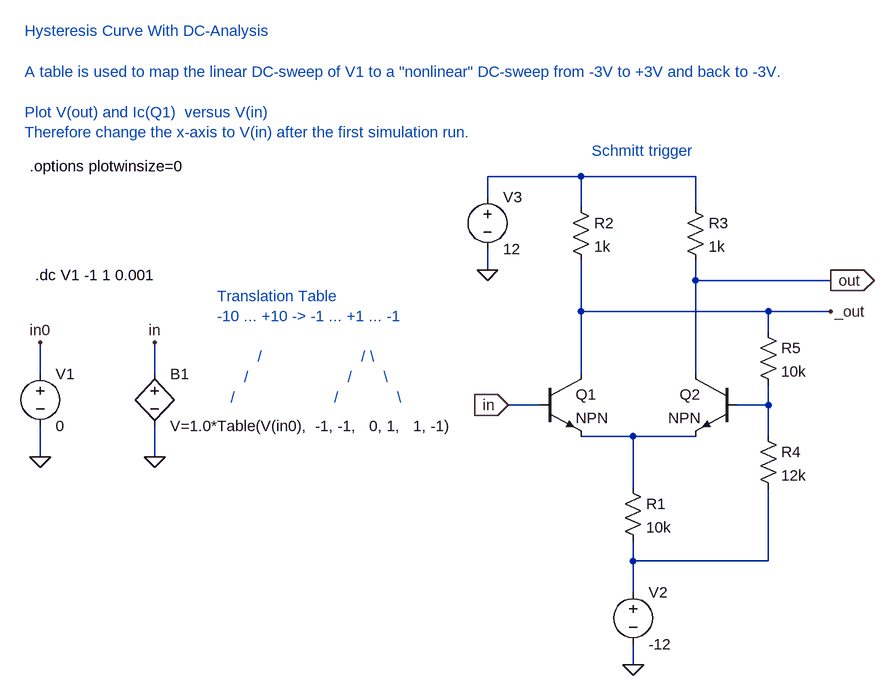
[diagram p0: schematic Hysteresis_dc_plot.asc]
Hysteresis_dc_plot.asc, the LTspice schematic file:
Version 4
SHEET 1 896 680
WIRE -432 240 -432 288
WIRE -432 160 -432 112
WIRE -256 240 -256 288
WIRE -256 160 -256 112
WIRE 400 256 480 256
WIRE 480 256 480 336
WIRE 480 256 576 256
WIRE 400 -16 400 64
WIRE 400 -96 400 -144
WIRE 400 -144 576 -144
WIRE 576 -144 576 -96
WIRE 576 -16 576 16
WIRE 688 256 688 208
WIRE 688 208 640 208
WIRE 400 64 688 64
WIRE 400 64 400 160
WIRE 688 64 688 96
WIRE 688 176 688 208
WIRE 688 336 688 448
WIRE 688 448 480 448
WIRE 480 448 480 416
WIRE 256 -112 256 -144
WIRE 256 -144 400 -144
WIRE 256 -32 256 0
WIRE 480 496 480 448
WIRE 480 608 480 576
WIRE 336 208 288 208
WIRE 576 16 784 16
WIRE 576 16 576 160
WIRE 688 64 784 64
FLAG -432 288 0
FLAG -432 112 in0
FLAG -256 288 0
FLAG -256 112 in
FLAG 256 0 0
FLAG 480 608 0
FLAG 288 208 in
IOPIN 288 208 In
FLAG 784 16 out
IOPIN 784 16 Out
FLAG 784 64 _out
SYMBOL voltage -432 144 R0
SYMATTR InstName V1
SYMATTR Value 0
SYMBOL bv -256 144 R0
SYMATTR InstName B1
SYMATTR Value V=1.0*Table(V(in0),  -1, -1,   0, 1,   1, -1)
SYMBOL npn 336 160 R0
SYMATTR InstName Q1
SYMBOL npn 640 160 M0
SYMATTR InstName Q2
SYMBOL res 464 320 R0
SYMATTR InstName R1
SYMATTR Value 10k
SYMBOL res 384 -112 R0
SYMATTR InstName R2
SYMATTR Value 1k
SYMBOL res 560 -112 R0
SYMATTR InstName R3
SYMATTR Value 1k
SYMBOL res 672 240 R0
SYMATTR InstName R4
SYMATTR Value 12k
SYMBOL res 672 80 R0
SYMATTR InstName R5
SYMATTR Value 10k
SYMBOL voltage 480 480 R0
SYMATTR InstName V2
SYMATTR Value -12
SYMBOL voltage 256 -128 R0
SYMATTR InstName V3
SYMATTR Value 12
TEXT -440 8 Left 0 !.dc V1 -1 1 0.001
TEXT -456 -368 Left 0 ;Hysteresis Curve With DC-Analysis\n \nA table is used to map the linear DC-sweep of V1 to a "nonlinear" DC-sweep from -3V to +3V and back to -3V.\n \nPlot V(out) and Ic(Q1)  versus V(in)\nTherefore change the x-axis to V(in) after the first simulation run.
TEXT 416 -184 Left 0 ;Schmitt trigger
TEXT -160 40 Left 0 ;Translation Table\n-10 ... +10 -> -1 ... +1 ... -1\n \n         /                      / \\      \n      /                      /       \\    \n   /                      /             \\
TEXT -448 -160 Left 0 !.options plotwinsize=0

The netlist it stands for:
* Hysteresis_dc_plot.asc
V1 in0 0 0
B1 in 0 V=1.0*Table(V(in0),  -1, -1,   0, 1,   1, -1)
Q1 _out in N001 0 NPN
Q2 out N003 N001 0 NPN
R1 N001 N004 10k
R2 N002 _out 1k
R3 N002 out 1k
R4 N003 N004 12k
R5 _out N003 10k
V2 N004 0 -12
V3 N002 0 12
.model NPN NPN
.model PNP PNP
.lib standard.bjt
.dc V1 -1 1 0.001
* Hysteresis Curve With DC-Analysis
* A table is used to map the linear DC-sweep of V1 to a "nonlinear" DC-sweep from -3V to +3V and back to -3V.
* Plot V(out) and Ic(Q1)  versus V(in)
* Therefore change the x-axis to V(in) after the first simulation run.
* Schmitt trigger
* Translation Table
* -10 ... +10 -> -1 ... +1 ... -1
*          /                      / \
*       /                      /       \
*    /                      /             \
.options plotwinsize=0
.backanno
.end